# Altium schematic sheet STM32F429VET6.SchDoc
size A4
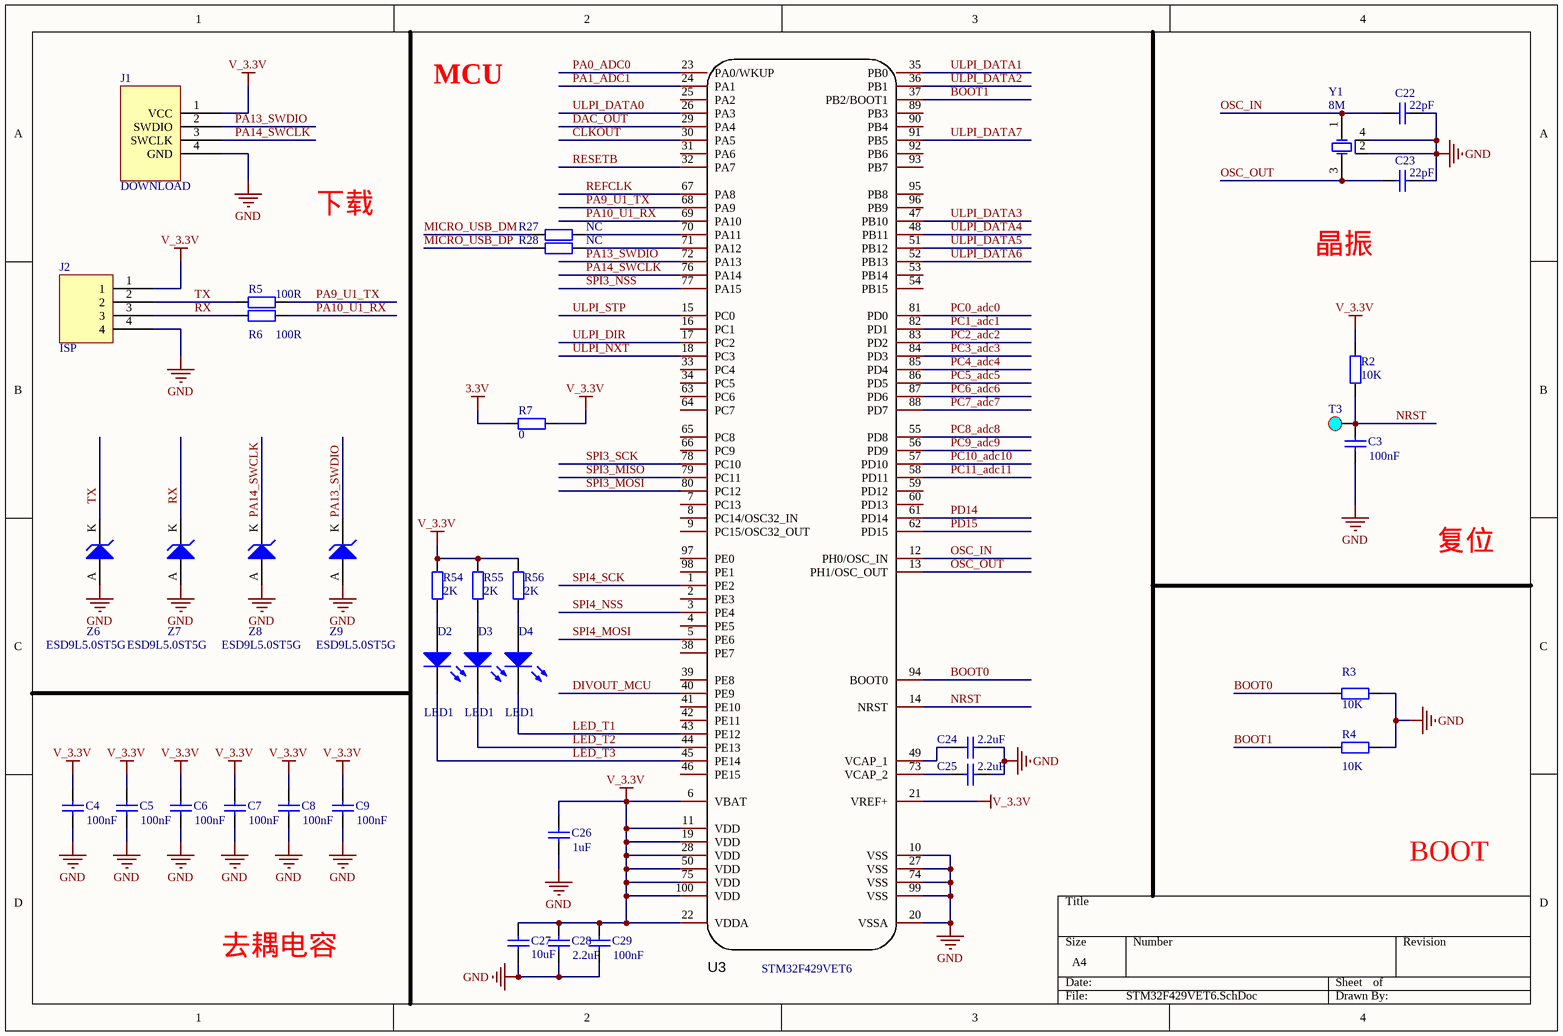
[diagram p0: STM32F429VET6.SchDoc]

## Parts
C3  100nF  [C0402]
C4  100nF  [C0402]
C5  100nF  [C0402]
C6  100nF  [C0402]
C7  100nF  [C0402]
C8  100nF  [C0402]
C9  100nF  [C0402]
C22  22pF  [C0402]
C23  22pF  [C0402]
C24  2.2uF  [C0402]
C25  2.2uF  [C0402]
C26  1uF  [C0402]
C27  10uF  [C0603]
C28  2.2uF  [C0402]
C29  100nF  [C0402]
D2  LED1  [LED-0603]
D3  LED1  [LED-0603]
D4  LED1  [LED-0603]
J1  DOWNLOAD  [J4]
J2  ISP  [J4]
R2  10K  [R0402]
R3  10K  [R0402]
R4  10K  [R0402]
R5  100R  [R0402]
R6  100R  [R0402]
R7  0  [R0402]
R27  NC  [R0402]
R28  NC  [R0402]
R54  2K  [R0402]
R55  2K  [R0402]
R56  2K  [R0402]
T3  (no value)  [TestPoints-0.7]
U3  STM32F429VET6  [LQFP-100_L14.0-W14.0-P0.50-LS16.0-BL]
Y1  8M  [CRYSTAL_3.2*2.5]
Z6  ESD9L5.0ST5G  [SOD-923]
Z7  ESD9L5.0ST5G  [SOD-923]
Z8  ESD9L5.0ST5G  [SOD-923]
Z9  ESD9L5.0ST5G  [SOD-923]

## Nets
3.3V: R7.2
GND: C3.2 C4.2 C5.2 C6.2 C7.2 C8.2 C9.2 C22.2 C23.2 C24.2 C25.2 C26.2 C27.2 C28.2 C29.2 J1.4(GND) J2.4 R3.2 R4.1 U3.10(VSS) U3.20(VSSA) U3.27(VSS) U3.74(VSS) U3.99(VSS) Y1.2(GROUND) Y1.4(GROUND) Z6.A Z7.A Z8.A Z9.A
V_3.3V: C4.1 C5.1 C6.1 C7.1 C8.1 C9.1 C26.1 C27.1 C28.1 C29.1 J1.1(VCC) J2.1 R2.1 R7.1 R54.1 R55.1 R56.1 U3.6(VBAT) U3.11(VDD) U3.19(VDD) U3.21(VREF+) U3.22(VDDA) U3.28(VDD) U3.50(VDD) U3.75(VDD) U3.100(VDD)
BOOT0: R3.1 U3.94(BOOT0)
BOOT1: R4.2 U3.37(PB2/BOOT1)
CLKOUT: U3.30(PA5)
DAC_OUT: U3.29(PA4)
DIVOUT_MCU: U3.40(PE9)
LED_T1: D4.2(K) U3.43(PE12)
LED_T2: D3.2(K) U3.44(PE13)
LED_T3: D2.2(K) U3.45(PE14)
MICRO_USB_DM: R27.2
MICRO_USB_DP: R28.2
NRST: C3.1 R2.2 T3.1 U3.14(NRST)
OSC_IN: C22.1 U3.12(PH0/OSC_IN) Y1.1(INPUT)
OSC_OUT: C23.1 U3.13(PH1/OSC_OUT) Y1.3(OUTPUT)
PA0_ADC0: U3.23(PA0/WKUP)
PA1_ADC1: U3.24(PA1)
PA9_U1_TX: R5.1 U3.68(PA9)
PA10_U1_RX: R6.1 U3.69(PA10)
PA13_SWDIO: J1.2(SWDIO) U3.72(PA13) Z9.K
PA14_SWCLK: J1.3(SWCLK) U3.76(PA14) Z8.K
PC0_adc0: U3.81(PD0)
PC1_adc1: U3.82(PD1)
PC2_adc2: U3.83(PD2)
PC3_adc3: U3.84(PD3)
PC4_adc4: U3.85(PD4)
PC5_adc5: U3.86(PD5)
PC6_adc6: U3.87(PD6)
PC7_adc7: U3.88(PD7)
PC8_adc8: U3.55(PD8)
PC9_adc9: U3.56(PD9)
PC10_adc10: U3.57(PD10)
PC11_adc11: U3.58(PD11)
PD14: U3.61(PD14)
PD15: U3.62(PD15)
REFCLK: U3.67(PA8)
RESETB: U3.32(PA7)
RX: J2.3 R6.2 Z7.K
SPI3_MISO: U3.79(PC11)
SPI3_MOSI: U3.80(PC12)
SPI3_NSS: U3.77(PA15)
SPI3_SCK: U3.78(PC10)
SPI4_MOSI: U3.5(PE6)
SPI4_NSS: U3.3(PE4)
SPI4_SCK: U3.1(PE2)
TX: J2.2 R5.2 Z6.K
ULPI_DATA0: U3.26(PA3)
ULPI_DATA1: U3.35(PB0)
ULPI_DATA2: U3.36(PB1)
ULPI_DATA3: U3.47(PB10)
ULPI_DATA4: U3.48(PB11)
ULPI_DATA5: U3.51(PB12)
ULPI_DATA6: U3.52(PB13)
ULPI_DATA7: U3.91(PB5)
ULPI_DIR: U3.17(PC2)
ULPI_NXT: U3.18(PC3)
ULPI_STP: U3.15(PC0)
NetC24_1: C24.1 U3.49(VCAP_1)
NetC25_1: C25.1 U3.73(VCAP_2)
NetD2_1: D2.1(A) R54.2
NetD3_1: D3.1(A) R55.2
NetD4_1: D4.1(A) R56.2
NetR27_1: R27.1 U3.70(PA11)
NetR28_1: R28.1 U3.71(PA12)

Not connected (* = marked no-connect by the designer): U3 2(PE3) 4(PE5) 7(PC13) 8(PC14/OSC32_IN) 9(PC15/OSC32_OUT) 16(PC1) 25(PA2) 31(PA6) 33(PC4) 34(PC5) 38(PE7) 39(PE8) 41(PE10) 42(PE11) 46(PE15) 53(PB14) 54(PB15) 59(PD12) 60(PD13) 63(PC6) 64(PC7) 65(PC8) 66(PC9) 89(PB3) 90(PB4) 92(PB6) 93(PB7) 95(PB8) 96(PB9) 97(PE0) 98(PE1)

## Notes on the sheet
- MCU
- 下载
- 晶振
- 复位
- BOOT
- 去耦电容

## Library data of the parts
C3-C9 C22-C29 = Cap: Capacitor; Published: 8-Jun-2000; LatestRevisionDate: 17-Jul-2002; LatestRevisionNote: Re-released for DXP Platform.; PackageReference: RAD-0.3; Publisher: Altium Limited; PackageDescription: Radial Cap, Thru-Hole; 2 Leads; 0.3 in Pin Spacing
  C3-C9 C29: Value: 100nF
  C22 C23: Value: 22pF
  C24 C25 C28: Value: 2.2uF
  C26: Value: 1uF
  C27: Value: 10uF
D2-D4 = LED1: Typical RED GaAs LED; Published: 8-Jun-2000; LatestRevisionDate: 08-Jul-2005; LatestRevisionNote: Mech Layer 1 removed.; PackageReference: LED-1; Publisher: Altium Limited; PackageDescription: LED; 2 Leads
J1 = 下载
J2 = J4
R2-R7 R27 R28 R54-R56 = Res2: Resistor; Published: 8-Jun-2000; LatestRevisionDate: 17-Jul-2002; LatestRevisionNote: Re-released for DXP Platform.; PackageReference: AXIAL-0.4; Publisher: Altium Limited; PackageDescription: Axial Device, Thru-Hole; 2 Leads; 0.4 in Pin Spacing
  R2-R4: Value: 10K
  R5 R6: Value: 100R
  R7: Value: 0
  R27 R28: Value: NC
  R54-R56: Value: 2K
T3 = TestPoints
U3 = STM32F429VET6: Manufacturer: ST(意法半导体); Add into BOM: yes; Speed: 180MHz; Voltage - Supply (Vcc/Vdd): 1.8V ~ 3.6V; Program Memory Size: 512KB; RAM Size: 256KB; Number of I/O: 82; A/D: 16x12bit; D/A: 2x12bit; PWM: 56; LCD: LCD TFT Controller up to 1024x728; UART/USART: 4 USART+4 UART; SPI: 4; I2C（SMBUS/PMBUS）: 3; USB Device: 1; CAN: 2; Ethernet: 10/100 Ethernet MAC; Name: STM32F429VET6; Symbol: STM32F429VET6; Device: STM32F429VET6; LCSC Part Name: STM32F429VET6; Supplier Part: C95447; Manufacturer Part: STM32F429VET6; Supplier Footprint: LQFP-100_14x14x05P; JLCPCB Part Class: Extended Part; Datasheet: https://atta.szlcsc.com/upload/public/pdf/source/20170918/C95447_1505700207508975047.pdf; Supplier: LCSC; Convert to PCB: yes; USB Host/OTG: 1; Features: I2S,SAI
Y1 = CRYSTAL-PASSIVE_3225
Z6-Z9 = D Zener: Zener Diode; Published: 8-Jun-2000; LatestRevisionDate: 17-Jul-2002; LatestRevisionNote: Re-released for DXP Platform.; PackageReference: DIODE-0.7; Publisher: Altium Limited; PackageDescription: Diode, Thru-Hole; 2 Leads; 0.7 in Pin Spacing